# EAGLE design untitled (EAGLE 9.6.2)
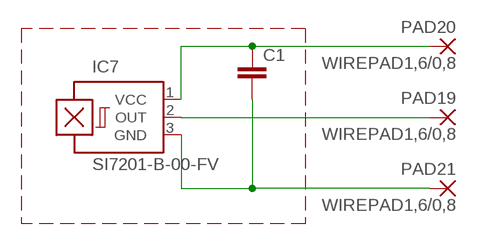
[diagram p0: schematic, sheet 1]

## Parts
C1  C-EUC0402  [C0402]
IC7  SI7201-B-00-FV  A1202LH  [SOT23-W]
PAD19  WIREPAD1,6/0,8  [1,6/0,8]
PAD20  WIREPAD1,6/0,8  [1,6/0,8]
PAD21  WIREPAD1,6/0,8  [1,6/0,8]

## Nets
GND1: C1.2 IC7.3(GND) PAD21.1(P)
N$17: IC7.2(OUT) PAD19.1(P)
VDD1: C1.1 IC7.1(VCC) PAD20.1(P)

## Library data of the parts
C1 = rcl:C-EU: CAPACITOR, European symbol; SPICEPREFIX: C
IC7 = allegro:A12*?: Hall-effect bipolar switch Source: http://www.allegromicro.com/en/Products/Part_Numbers/1202/1202.pdf; OC_FARNELL: unknown; OC_NEWARK: unknown
PAD19-PAD21 = 4 PAD:WIREPAD: Wire PAD connect wire on PCB

## Board
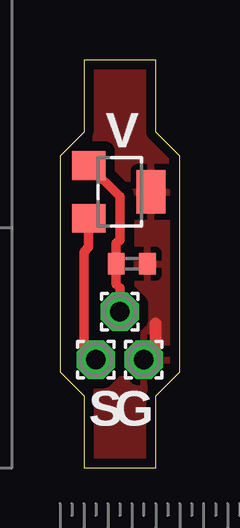
[diagram p1: board, top side]

Size 5 x 17 mm. Coordinates in mm from the lower left corner, seen from the top.
Outline: 4,0 4,3 5,4 5,13 4,14 4,17 1,17 1,14 0,13 0,4 1,3 1,0 4,0
Copper layers (1*16): Top 0.035mm / dielectric 1.5mm / Bottom 0.035mm
Design rules "SeeedStudio_2layer_DRU_no_angle_20140221_IMD555": minimum track width 0.2mm, minimum drill 0.3mm, track to track 0.2mm, track to pad 0.2mm, pad to pad 0.2mm, via to via 0.2mm, smd to smd 0mil, copper to edge 0.2mm, drill to drill 10mil, minimum pad ring 0.25mm, minimum via ring 0.2mm, stop-mask expansion 0.03mm, vias tented up to drill 5mm, thermal gap 10mil

### Footprints (pad centres in the part's own frame; a part is rotated, then mirrored left to right if it is on the bottom)
C0402 = smd 0.7 x 0.9: 1 -0.65,0; 2 0.65,0
SOT23-W = smd 1.2 x 1.4: 1 -1.1,-1.3; 2 1.1,-1.3 | smd 1.8 x 1.2: 3 0,1.3
1,6/0,8 = drill 0.813 pad 1.6 octagon: 1 0,0

### Placement (x,y rotation side)
C1  3,8.5 0 top
IC7  2.5,11.5 270 top
PAD19  1.5,4.5 0 top
PAD20  2.5,6.5 0 top
PAD21  3.5,4.5 0 top
U$1  [RULER-S]  0,-4.5 0 top  (outside the outline)
U$4  [RULER-S]  -2,0 90 top

### Tracks (layer width: path | path; a pad name or v marks a point on that pad's centre or on a via)
GND1
  Top 0.5: PAD21.1 4,5 4,6
  pour Top (isolate 0.4, rank 6): 0,17 5,17 5,0 0,0
N$17
  Top 0.4: IC7.2 1.2,9.2 1,9 1,5 PAD19.1
VDD1
  Top 0.4: IC7.1 2.5,11.3 2.5,9.5 2.35,9.35 C1.1 2.35,7.65 2.5,7.5 PAD20.1

### Text on the board
tPlace: V | S | G